# Altium schematic sheet CC-S08-V00-Connector.SchDoc: Connector (Superseal 1.0, 60 Pin, Right Angle)
size A3; DrawnBy: Jonn Dillon; DocumentNumber: 9; SheetNumber: 9; SheetTotal: 13; Project: Chassis Controller (Interim) 2020
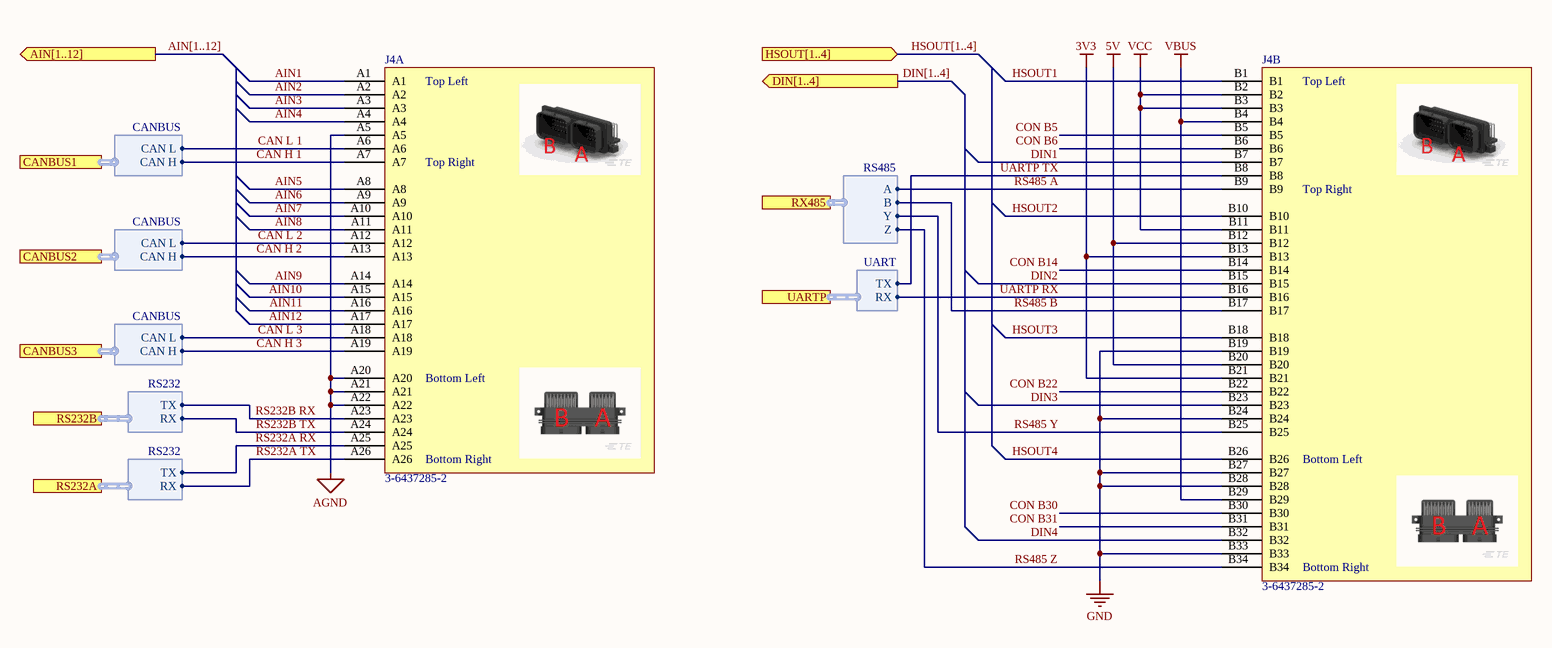
[diagram p0: CC-S08-V00-Connector.SchDoc]

## Parts
J4  3-6437285-2  [SUPERSEAL RIGHT 60WAY]  (parts A,B of 2)

## Ports
AIN[1..12] (out), CANBUS1 (harness CANBUS), CANBUS2 (harness CANBUS), CANBUS3 (harness CANBUS), DIN[1..4] (out), HSOUT[1..4] (in), RS232A (harness RS232), RS232B (harness RS232), RX485 (harness RS485), UARTP (harness UART)

## Harnesses
CANBUS: CAN H, CAN L
RS232: TX, RX
RS485: A, B, Y, Z
UART: TX, RX

## Nets
3V3: J4.B13 J4.B21
5V: J4.B12 J4.B20
AGND: J4.A5 J4.A20 J4.A21 J4.A22
GND: J4.B19 J4.B24 J4.B27 J4.B28 J4.B33
VBUS: J4.B4 J4.B29
VCC: J4.B2 J4.B3 J4.B11
AIN1: J4.A1
AIN2: J4.A2
AIN3: J4.A3
AIN4: J4.A4
AIN5: J4.A8
AIN6: J4.A9
AIN7: J4.A10
AIN8: J4.A11
AIN9: J4.A14
AIN10: J4.A15
AIN11: J4.A16
AIN12: J4.A17
CAN H 1: J4.A7 ; port CANBUS1.CAN H
CAN H 2: J4.A13 ; port CANBUS2.CAN H
CAN H 3: J4.A19 ; port CANBUS3.CAN H
CAN L 1: J4.A6 ; port CANBUS1.CAN L
CAN L 2: J4.A12 ; port CANBUS2.CAN L
CAN L 3: J4.A18 ; port CANBUS3.CAN L
CON B5: J4.B5
CON B6: J4.B6
CON B14: J4.B14
CON B22: J4.B22
CON B30: J4.B30
CON B31: J4.B31
DIN1: J4.B7
DIN2: J4.B15
DIN3: J4.B23
DIN4: J4.B32
HSOUT1: J4.B1
HSOUT2: J4.B10
HSOUT3: J4.B18
HSOUT4: J4.B26
RS232A RX: J4.A25 ; port RS232A.TX
RS232A TX: J4.A26 ; port RS232A.RX
RS232B RX: J4.A23 ; port RS232B.TX
RS232B TX: J4.A24 ; port RS232B.RX
RS485 A: J4.B9 ; port RX485.A
RS485 B: J4.B17 ; port RX485.B
RS485 Y: J4.B25 ; port RX485.Y
RS485 Z: J4.B34 ; port RX485.Z
UARTP RX: J4.B16 ; port UARTP.RX
UARTP TX: J4.B8 ; port UARTP.TX

## Buses and harness runs
bus AIN[1..12] = port AIN[1..12]
bus DIN[1..4] = port DIN[1..4]
bus HSOUT[1..4] = port HSOUT[1..4]

## Notes on the sheet
- Revision History:
- Sheet Title:
- Rev
- Date
- Description
- Project:
- Size:
- Drawn By:
- A3
- Number:
- Revision:
- Sheet
- Version:
- of
- QUT Motorsport
- O-120, Gardens Point
- 2 George Street
- Brisbane, QLD 4000
- Australia
- Print Date:
- Print Time:
- File Name:
- (in symbol 3-6437285-2, part A) Top Left; Top Right; Bottom Left; Bottom Right
- (in symbol 3-6437285-2, part B) Top Left; Top Right; Bottom Left; Bottom Right

## Library data of the parts
J4 = 3-6437285-2: Connector Header Through Hole, Right Angle 60 position 0.118" (3.00mm); ComponentLink1Description: Digikey; ComponentLink1URL: https://www.digikey.com.au/products/en?keywords=3-6437285-2; ComponentLink2Description: TE; ComponentLink2URL: https://www.te.com/global-en/product-3-6437285-2.html